# Altium schematic sheet MCU_PFC161.SchDoc
size A4
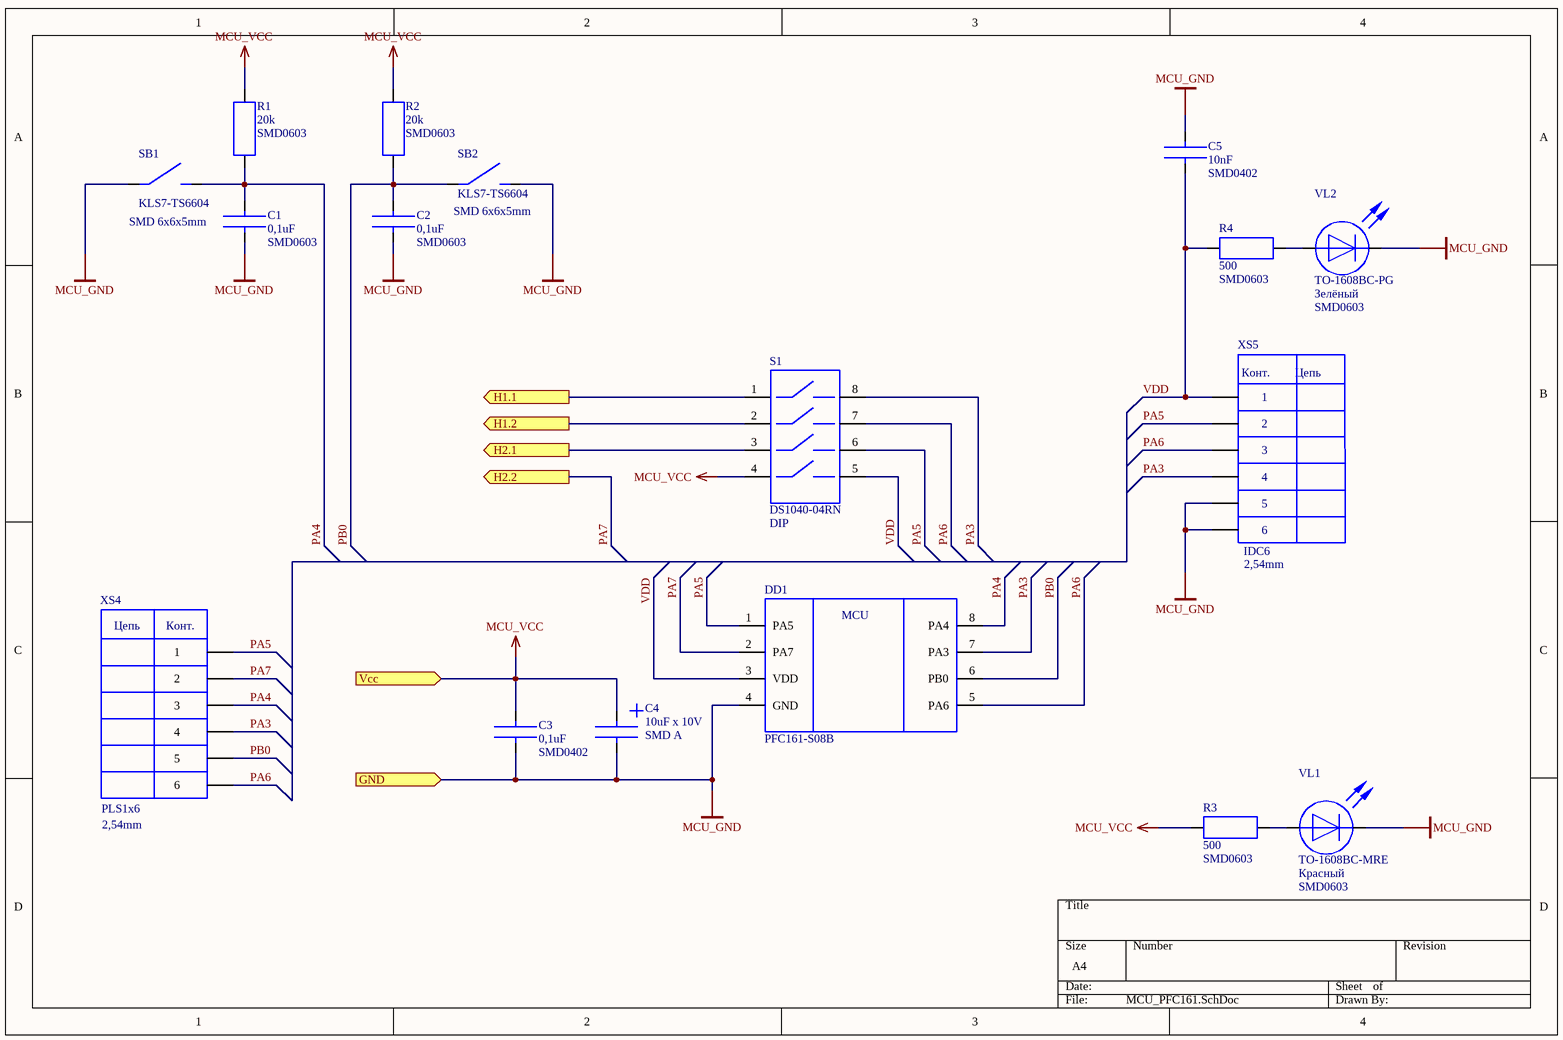
[diagram p0: MCU_PFC161.SchDoc]

## Parts
C1  0,1uF  Package: SMD0603  [SMD0603(1005)]
C2  0,1uF  Package: SMD0603  [SMD0603(1005)]
C3  0,1uF  Package: SMD0402  [SMD0402(1608)]
C4  10uF x 10V  Package: SMD A  [TANT_CAP_A(3216)]
C5  10nF  Package: SMD0402  [SMD0603(1005)]
DD1  PFC161-S08B  [SOIC8]
R1  20k  Package: SMD0603  [SMD0603(1005)]
R2  20k  Package: SMD0603  [SMD0603(1005)]
R3  500  Package: SMD0603  [SMD0603(1005)]
R4  500  Package: SMD0603  [SMD0603(1005)]
S1  DS1040-04RN  Package: DIP  [DIP_SWITCH_4_2.54]
SB1  KLS7-TS6604  Package: SMD 6х6х5mm  [KLS7-TS6604 (IT-1102SA)]
SB2  KLS7-TS6604  Package: SMD 6х6х5mm  [KLS7-TS6604 (IT-1102SA)]
VL1  TO-1608BC-MRE  Light: Красный  Package: SMD0603  [LED_SMD0603(1005)]
VL2  TO-1608BC-PG  Light: Зелёный  Package: SMD0603  [LED_SMD0603(1005)]
XS4  PLS1x6  Package: 2,54mm  [PLS1x6]
XS5  IDC6  Package: 2,54mm  [IDC-6 (2.54)]

## Ports
GND (in), H1.1 (out), H1.2 (out), H2.1 (out), H2.2 (out), Vcc (in)

## Nets
MCU_GND: C1.1 C2.1 C3.2 C4.2 C5.1 DD1.4(GND) SB1.1 SB2.2 VL1.2 VL2.2 XS5.5 XS5.6 ; port GND
MCU_VCC: C3.1 C4.1 R1.2 R2.2 R3.1 S1.4 ; port Vcc
H1.1: S1.1 ; port H1.1
H1.2: S1.2 ; port H1.2
H2.1: S1.3 ; port H2.1
PA3: DD1.7(PA3) S1.8 XS4.4 XS5.4
PA4: C1.2 DD1.8(PA4) R1.1 SB1.2 XS4.3
PA5: DD1.1(PA5) S1.6 XS4.1 XS5.2
PA6: DD1.5(PA6) S1.7 XS4.6 XS5.3
PA7: DD1.2(PA7) XS4.2 ; port H2.2
PB0: C2.2 DD1.6(PB0) R2.1 SB2.1 XS4.5
VDD: C5.2 DD1.3(VDD) R4.1 S1.5 XS5.1
NetR3_2: R3.2 VL1.1
NetR4_2: R4.2 VL2.1

## Notes on the sheet
- (in symbol IDC6) Конт.; Цепь
- (in symbol PFC161-S08B) MCU
- (in symbol PLS1x6) Цепь; Конт.

## Library data of the parts
C1 C2 = CER_CUP_0603: Type: C; ValueBOM: Конденсатор керамический 0,1мкФ SMD 0603 1%; Value: 0,1uF
C3 = CER_CUP_0402: Type: C; ValueBOM: Конденсатор керамический 0,1мкФ х 50В SMD 0402 1%; Value: 0,1uF
C4 = C_TANT_A: Type: C; ValueBOM: Конденсатор танталовый 10мкФ х 10В SMD A; Value: 10uF x 10V
C5 = CER_CUP_0402: Type: C; ValueBOM: Конденсатор керамический 10нФ х 50В SMD 0402 1%; Value: 10nF
DD1 = PFC161-S08B: ValueBOM: Микроконтроллер PFC161-S08B, SOIC-8; Type: DD; Value: PFC161-S08B; Package: SOIC-8
R1 R2 = R_0603: ValueBOM: Резистор 20кОм SMD 0603 1%; Type: R; Value: 20k
R3 R4 = R_0603: ValueBOM: Резистор 500 Ом SMD 0603 1%; Type: R; Value: 500
S1 = Переключатель DIP DS1040-04RN: Value: DS1040-04RN; Type: S; ValueBOM: Переключатель DIP DS1040-04RN
SB1 SB2 = Кнопка KLS7-TS6604 (IT-1102SA): ValueBOM: KLS7-TS6604-5.0-180 (IT-1102SA), Кнопка тактовая 6х6х5мм SMD; Type: SB; Value: KLS7-TS6604
VL1 = LED_0603: ValueBOM: Светодиод Красный TO-1608BC-MRE SMD0603; Type: VL; Value: TO-1608BC-MRE
VL2 = LED_0603: ValueBOM: Светодиод Зелёный TO-1608BC-PG SMD0603; Type: VL; Value: TO-1608BC-PG
XS4 = PLS1x6: ValueBOM: Разъём PLS1x6 прямой; Type: XS; Value: PLS1x6
XS5 = IDC6: ValueBOM: Разъём IDC6 прямой; Type: XS; Value: IDC6